# EAGLE design 5V Stepdown (EAGLE 9.6.2)

## Sheet 1 of 2: BOTTOM BOARD
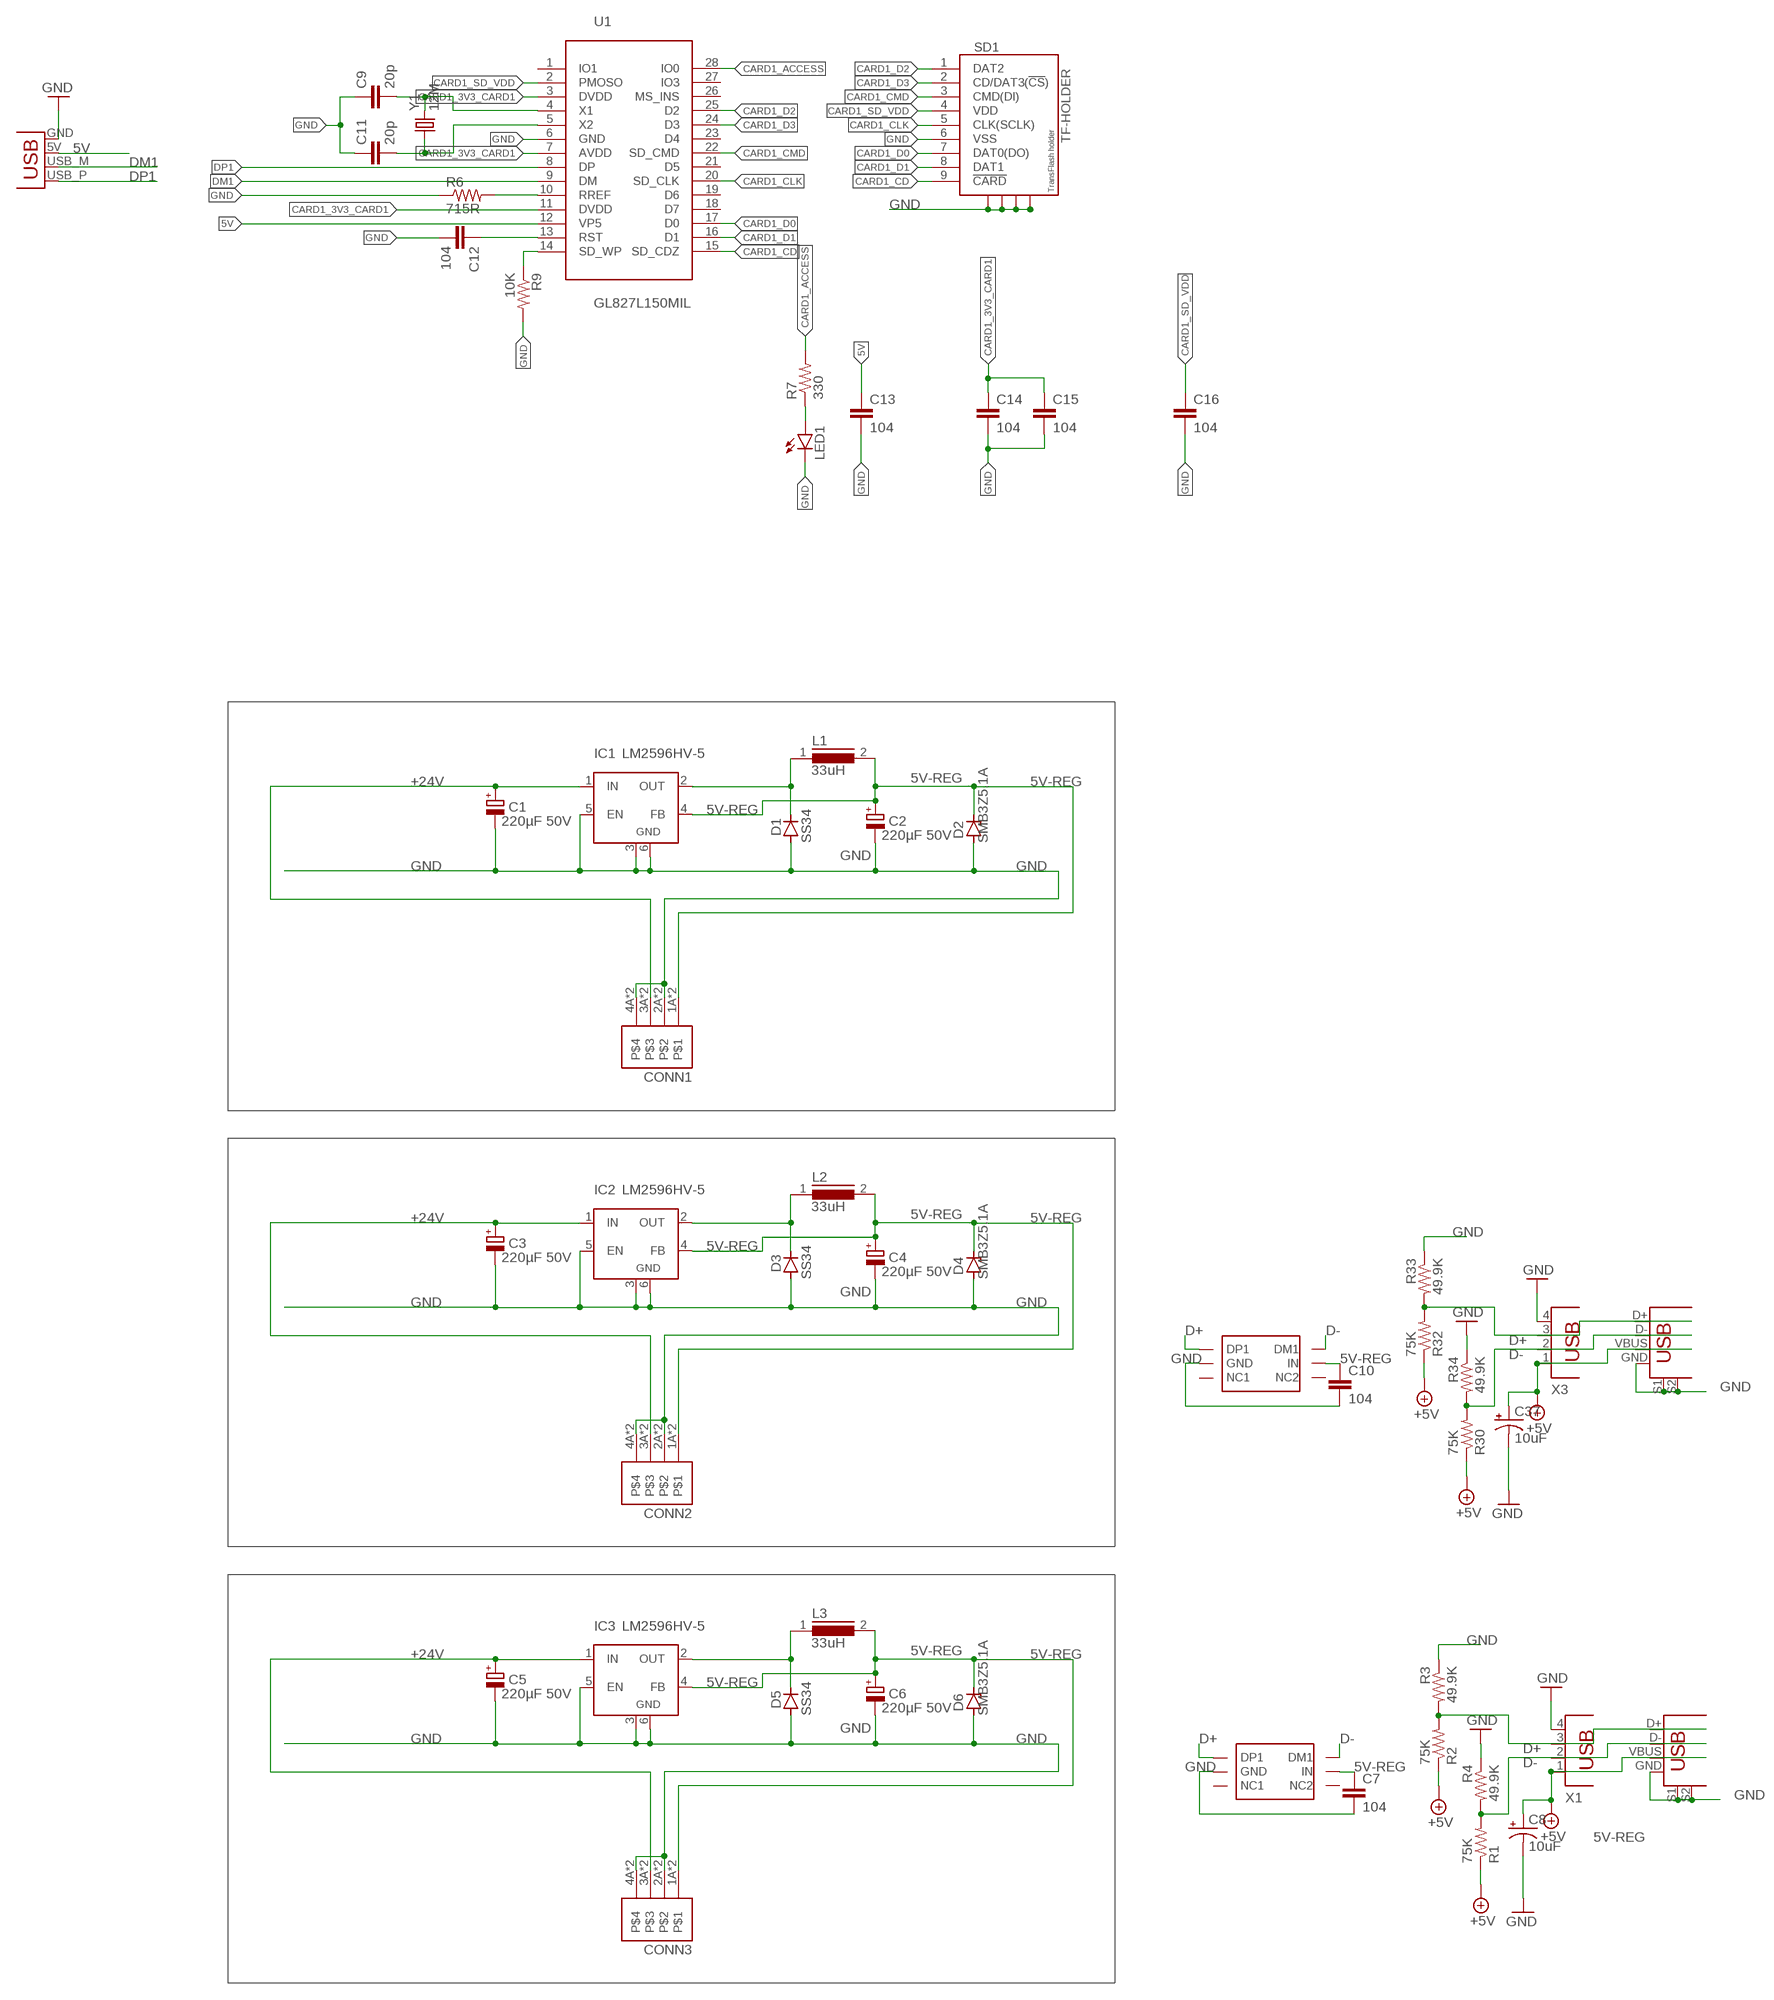
[diagram p0: schematic, sheet 1]

### Parts
C1  220µF 50V  CPOL-EUE  [PANASONIC_E]
C2  220µF 50V  CPOL-EUE  [PANASONIC_E]
C3  220µF 50V  CPOL-EUE  [PANASONIC_E]
C4  220µF 50V  CPOL-EUE  [PANASONIC_E]
C5  220µF 50V  CPOL-EUE  [PANASONIC_E]
C6  220µF 50V  CPOL-EUE  [PANASONIC_E]
C7  104  C-EUC1206  [C1206]
C8  10uF  CAP_POL1206  [EIA3216]
C9  20p  CAP1206  [1206]
C10  104  C-EUC1206  [C1206]
C11  20p  CAP1206  [1206]
C12  104  CAP1206  [1206]
C13  104  CAP1206  [1206]
C14  104  CAP1206  [1206]
C15  104  CAP1206  [1206]
C16  104  CAP1206  [1206]
C37  10uF  CAP_POL1206  [EIA3216]
CONN1  WJ212R-THR-3.5-4  [WJ212R-THR-3.5-4]
CONN2  WJ212R-THR-3.5-4  [WJ212R-THR-3.5-4]
CONN3  WJ212R-THR-3.5-4  [WJ212R-THR-3.5-4]
D1  SS34  D-SOD-87  [SOD87]
D2  SMB3Z5.1A  ZENER-DIODESMB  [SMB]
D3  SS34  D-SOD-87  [SOD87]
D4  SMB3Z5.1A  ZENER-DIODESMB  [SMB]
D5  SS34  D-SOD-87  [SOD87]
D6  SMB3Z5.1A  ZENER-DIODESMB  [SMB]
IC1  LM2596HV-5  LM2596S  [TO263-5]
IC2  LM2596HV-5  LM2596S  [TO263-5]
IC3  LM2596HV-5  LM2596S  [TO263-5]
L1  33uH  DR127  [DR127]
L2  33uH  DR127  [DR127]
L3  33uH  DR127  [DR127]
LED1  LED3MM  [LED3MM]
R1  75K  R-US_M1206  [M1206]
R2  75K  R-US_M1206  [M1206]
R3  49.9K  R-US_M1206  [M1206]
R4  49.9K  R-US_M1206  [M1206]
R6  715R  RESISTOR1206  [1206]
R7  330  RESISTOR1206  [1206]
R9  10K  RESISTOR1206  [1206]
R30  75K  R-US_M1206  [M1206]
R32  75K  R-US_M1206  [M1206]
R33  49.9K  R-US_M1206  [M1206]
R34  49.9K  R-US_M1206  [M1206]
SD1  TF-HOLDER  [TF-PULL]
U1  GL827L150MIL  [SSOP28-39]
U$1  TPS2514  [TPS2514]
U$2  TPS2514  [TPS2514]
U$3  USB+SHIELDUSB-A-S-NOSILK-FEMALE  [USB-A-S-NOSILK-FEMALE]
U$4  USB+SHIELDUSB-A-S-NOSILK-FEMALE  [USB-A-S-NOSILK-FEMALE]
X1  PN87520  [PN87520]
X2  USBPCB  [USB-A-PCB]
X3  PN87520  [PN87520]
Y1  12M  CRYSTAL2HC49US  [HC49US]

### Nets
5V: C13.1 U1.12(VP5) X2.5V(VBUS)
5V-REG: C2.+ C4.+ C6.+ C7.1 C8.A(+) C10.1 C37.A(+) CONN1.1A CONN1.1B CONN2.1A CONN2.1B CONN3.1A CONN3.1B D2.C D4.C D6.C IC1.4(FB) IC2.4(FB) IC3.4(FB) L1.2 L2.2 L3.2 R1.1 R2.1 R30.1 R32.1 U$1.IN U$2.IN U$3.VBUS U$4.VBUS X1.1 X3.1 ; supply symbol labelled +5V
+24V: C1.+ C3.+ C5.+ CONN1.3A CONN1.3B CONN2.3A CONN2.3B CONN3.3A CONN3.3B IC1.1(IN) IC2.1(IN) IC3.1(IN)
CARD1_3V3_CARD1: C14.1 C15.1 U1.3(DVDD) U1.7(AVDD) U1.11(DVDD)
CARD1_ACCESS: R7.2 U1.28(IO0)
CARD1_CD: SD1.9(!CARD) U1.15(SD_CDZ)
CARD1_CLK: SD1.5(CLK(SCLK)) U1.20(SD_CLK)
CARD1_CMD: SD1.3(CMD(DI)) U1.22(SD_CMD)
CARD1_D0: SD1.7(DAT0(DO)) U1.17(D0)
CARD1_D1: SD1.8(DAT1) U1.16(D1)
CARD1_D2: SD1.1(DAT2) U1.25(D2)
CARD1_D3: SD1.2(CD/DAT3(!CS!)) U1.24(D3)
CARD1_SD_VDD: C16.1 SD1.4(VDD) U1.2(PMOSO)
D+: R2.2 R3.2 R32.2 R33.2 U$1.DP1 U$2.DP1 U$3.D+ U$4.D+ X1.3 X3.3
D-: R1.2 R4.2 R30.2 R34.2 U$1.DM1 U$2.DM1 U$3.D- U$4.D- X1.2 X3.2
DM1: U1.9(DM) X2.USB_M(D-)
DP1: U1.8(DP) X2.USB_P(D+)
GND: C1.- C2.- C3.- C4.- C5.- C6.- C7.2 C8.C(-) C9.1 C10.2 C11.1 C12.2 C13.2 C14.2 C15.2 C16.2 C37.C(-) CONN1.2A CONN1.2B CONN1.4A CONN1.4B CONN2.2A CONN2.2B CONN2.4A CONN2.4B CONN3.2A CONN3.2B CONN3.4A CONN3.4B D1.2(A) D2.A D3.2(A) D4.A D5.2(A) D6.A IC1.3(GND) IC1.5(EN) IC1.6(GND) IC2.3(GND) IC2.5(EN) IC2.6(GND) IC3.3(GND) IC3.5(EN) IC3.6(GND) LED1.K(C) R3.1 R4.1 R6.1 R9.2 R33.1 R34.1 SD1.6(VSS) SD1.S1 SD1.S2 SD1.S3 SD1.S4 U1.6(GND) U$1.GND U$2.GND U$3.GND U$3.S1 U$3.S2 U$4.GND U$4.S1 U$4.S2 X1.4 X2.GND X3.4
N$2: C9.2 U1.4(X1) Y1.2
N$5: C11.2 U1.5(X2) Y1.1
N$10: R6.2 U1.10(RREF)
N$21: C12.1 U1.13(RST)
N$26: LED1.A R7.1
N$28: R9.1 U1.14(SD_WP)
SW-L: D1.1(C) IC1.2(OUT) L1.1
SW-L1: D3.1(C) IC2.2(OUT) L2.1
SW-L2: D5.1(C) IC3.2(OUT) L3.1
Unconnected: U1.1(IO1) U1.18(D7) U1.19(D6) U1.21(D5) U1.23(D4) U1.26(MS_INS) U1.27(IO3) U$1.NC2 U$1.NC(NC1) U$2.NC2 U$2.NC(NC1)

## Sheet 2 of 2

## Library data of the parts
C1-C6 = resistor:CPOL-EU: POLARIZED CAPACITOR, European symbol
C7 C10 = rcl:C-EU: CAPACITOR, European symbol
C8 C37 = SparkFun:CAP_POL: Capacitor Polarized These are standard SMD and PTH capacitors. Normally 10uF, 47uF, and 100uF in electrolytic and tantalum varieties. Always verify the external diameter of the through hole cap, it varies with capacity, voltage, and manufacturer. The EIA devices should be standard.
C9 C11-C16 = z_jlc_smt:CAP: Capacitor Standard 0603 ceramic capacitor, and 0.1" leaded capacitor.
CONN1-CONN3 = WJ212R-THR-3.5-3.81:WJ212R-THR-3.5-4
D1 D3 D5 = semicon-smd-ipc:D-: DIODE unfilled
D2 D4 D6 = diode:ZENER-DIODE: Z-Diode
IC1-IC3 = linear:LM2596S: STEP-DOWN VOLTAGE REGULATOR
L1-L3 = inductors:DR127: High Power Density, High Efficiency, Shielded Inductors Source: coiltronics_dr_series.pdf; SPICEPREFIX: L
LED1 = led:LED: LED OSRAM: - CHIPLED LG R971, LG N971, LY N971, LG Q971, LY Q971, LO R971, LY R971 LH N974, LH R974 LS Q976, LO Q976, LY Q976 LO Q996 - Hyper CHIPLED LW Q18S LB Q993, LB Q99A, LB R99A - SideLED LS A670, LO A670, LY A670, LG A670, LP A670 LB A673, LV A673, LT A673, LW A673 LH A674 LY A675 LS A676, LA A676, LO A676, LY A676, LW A676 LS A679, LY A679, LG A679 - Hyper Micro SIDELED® LS Y876, LA Y876, LO Y876, LY Y876 LT Y87S - SmartLED LW L88C, LW L88S LB L89C, LB L89S, LG L890 LS L89K, LO L89K, LY L89K LS L896, LA L896, LO L896, LY L896 - TOPLED LS T670, LO T670, LY T670, LG T670, LP T670 LSG T670, LSP T670, LSY T670, LOP T670, LYG T670 LG T671, LOG T671, LSG T671 LB T673, LV T673, LT T673, LW T673 LH T674 LS T676, LA T676, LO T676, LY T676, LB T676, LH T676, LSB T676, LW T676 LB T67C, LV T67C, LT T67C, LS T67K, LO T67K, LY T67K, LW E67C LS E67B, LA E67B, LO E67B, LY E67B, LB E67C, LV E67C, LT E67C LW T67C LS T679, LY T679, LG T679 LS T770, LO T770, LY T770, LG T770, LP T770 LB T773, LV T773, LT T773, LW T773 LH T774 LS E675, LA E675, LY E675, LS T675 LS T776, LA T776, LO T776, LY T776, LB T776 LHGB T686 LT T68C, LB T68C - Hyper Mini TOPLED® LB M676 - Mini TOPLED Santana® LG M470 LS M47K, LO M47K, LY M47K Source: http://www.osram.convergy.de LUXEON: - LUMILED® LXK2-PW12-R00, LXK2-PW12-S00, LXK2-PW14-U00, LXK2-PW14-V00 LXK2-PM12-R00, LXK2-PM12-S00, LXK2-PM14-U00 LXK2-PE12-Q00, LXK2-PE12-R00, LXK2-PE12-S00, LXK2-PE14-T00, LXK2-PE14-U00 LXK2-PB12-K00, LXK2-PB12-L00, LXK2-PB12-M00, LXK2-PB14-N00, LXK2-PB14-P00, LXK2-PB14-Q00 LXK2-PR12-L00, LXK2-PR12-M00, LXK2-PR14-Q00, LXK2-PR14-R00 LXK2-PD12-Q00, LXK2-PD12-R00, LXK2-PD12-S00 LXK2-PH12-R00, LXK2-PH12-S00 LXK2-PL12-P00, LXK2-PL12-Q00, LXK2-PL12-R00 Source: www.luxeon.com KINGBRIGHT: KA-3528ASYC Source: www.kingbright.com
R1-R4 R30 R32-R34 = adafruit:R-US_: RESISTOR, American symbol
R6 R7 R9 = z_jlc_smt:RESISTOR: Resistor Basic schematic elements and footprints for 0603, 1206, and PTH resistors.
SD1 = sd-mmc:TF-HOLDER: TF / Micro SD socket is PUSH-PUSH type, the card can be pushed into and auto locked and pushed out by simply press the card. Surface Mounting type.
U1 = xmgu2008:GL827L
U$1 U$2 = TPS2514:TPS2514
U$3 U$4 = SparkFun-Connectors:USB+SHIELD: USB+Shield USB connector with shield pins connectable
X1 X3 = con-berg:PN87520: BERG USB connector; OC_FARNELL: unknown; OC_NEWARK: unknown
X2 = SparkFun:USB: USB Connectors USB-B-PTH is fully proven SKU : PRT-00139 USB-miniB is fully proven SKU : PRT-00587 USB-A-PCB is untested. USB-A-H is throughly reviewed, but untested. Spark Fun Electronics SKU : PRT-00437 USB-B-SMT is throughly reviewed, but untested. Needs silkscreen touching up. USB-A-S has not been used/tested USB-MB-H has not been used/tested
Y1 = xmgu2008:CRYSTAL2: Various standard crystals. Proven footprints.

## Board
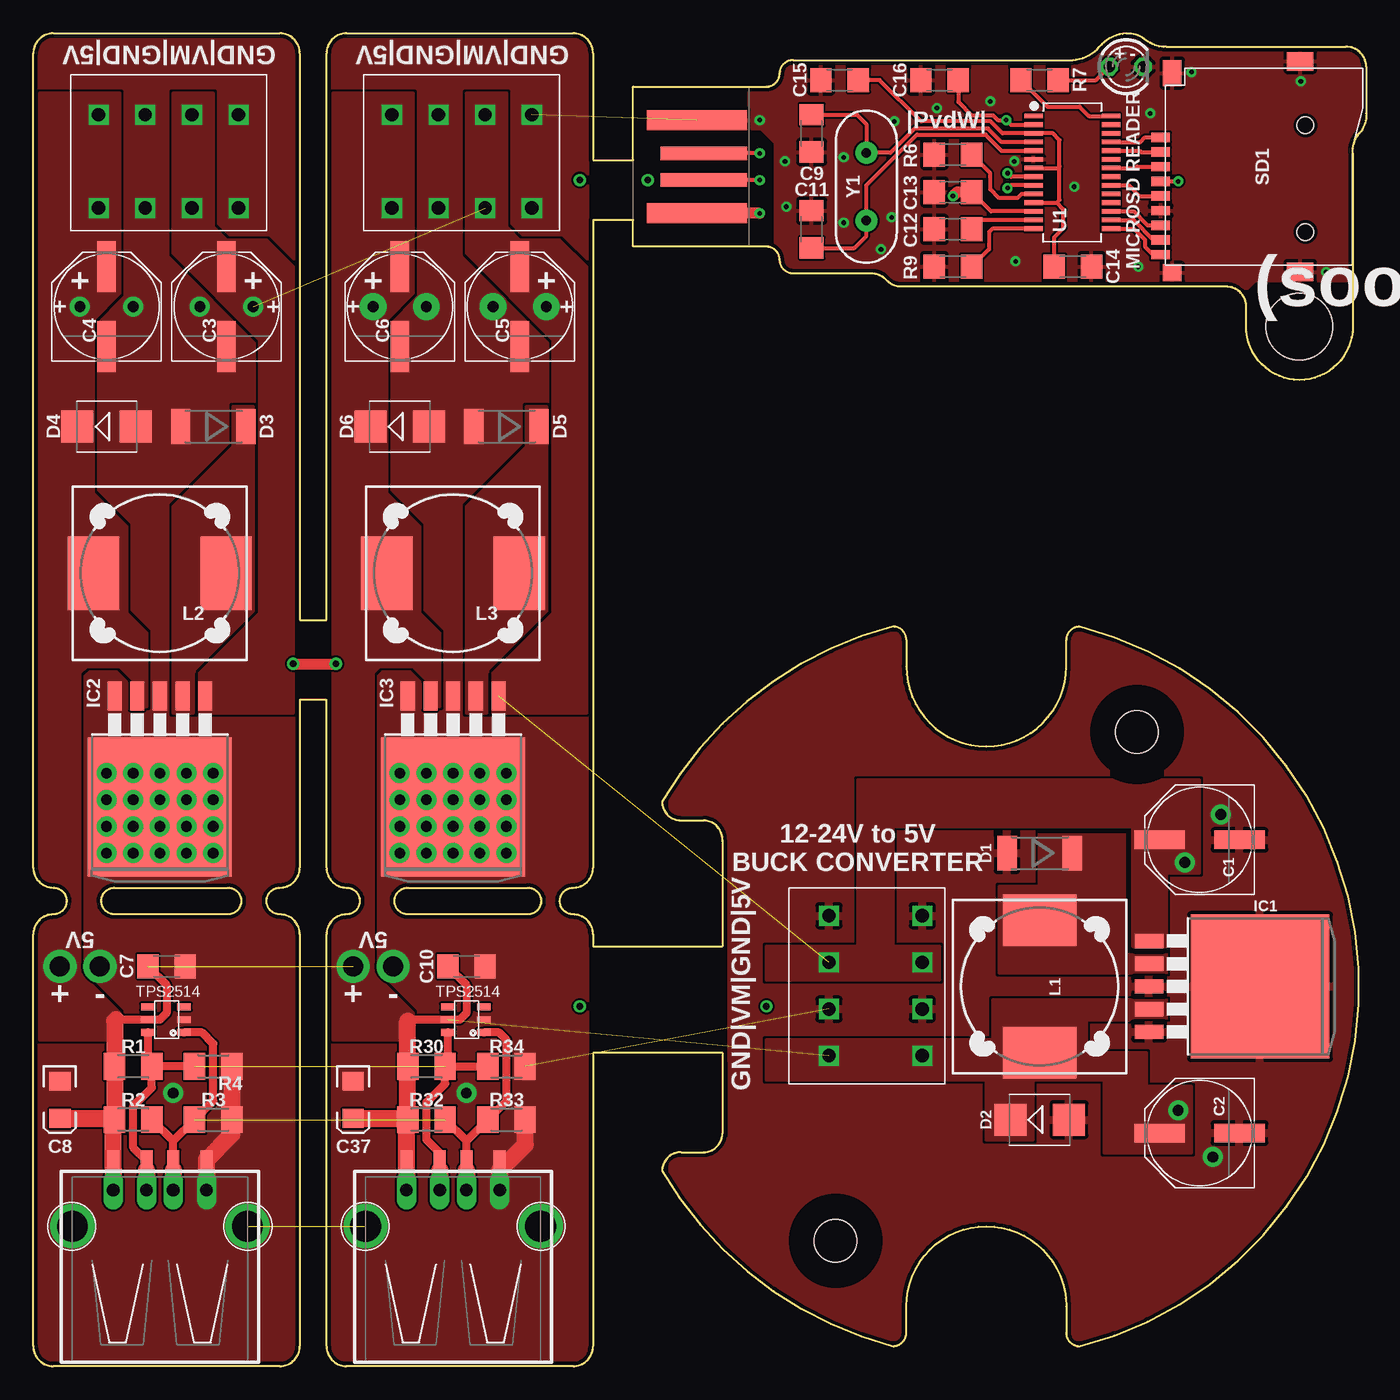
[diagram p1: board, top side]
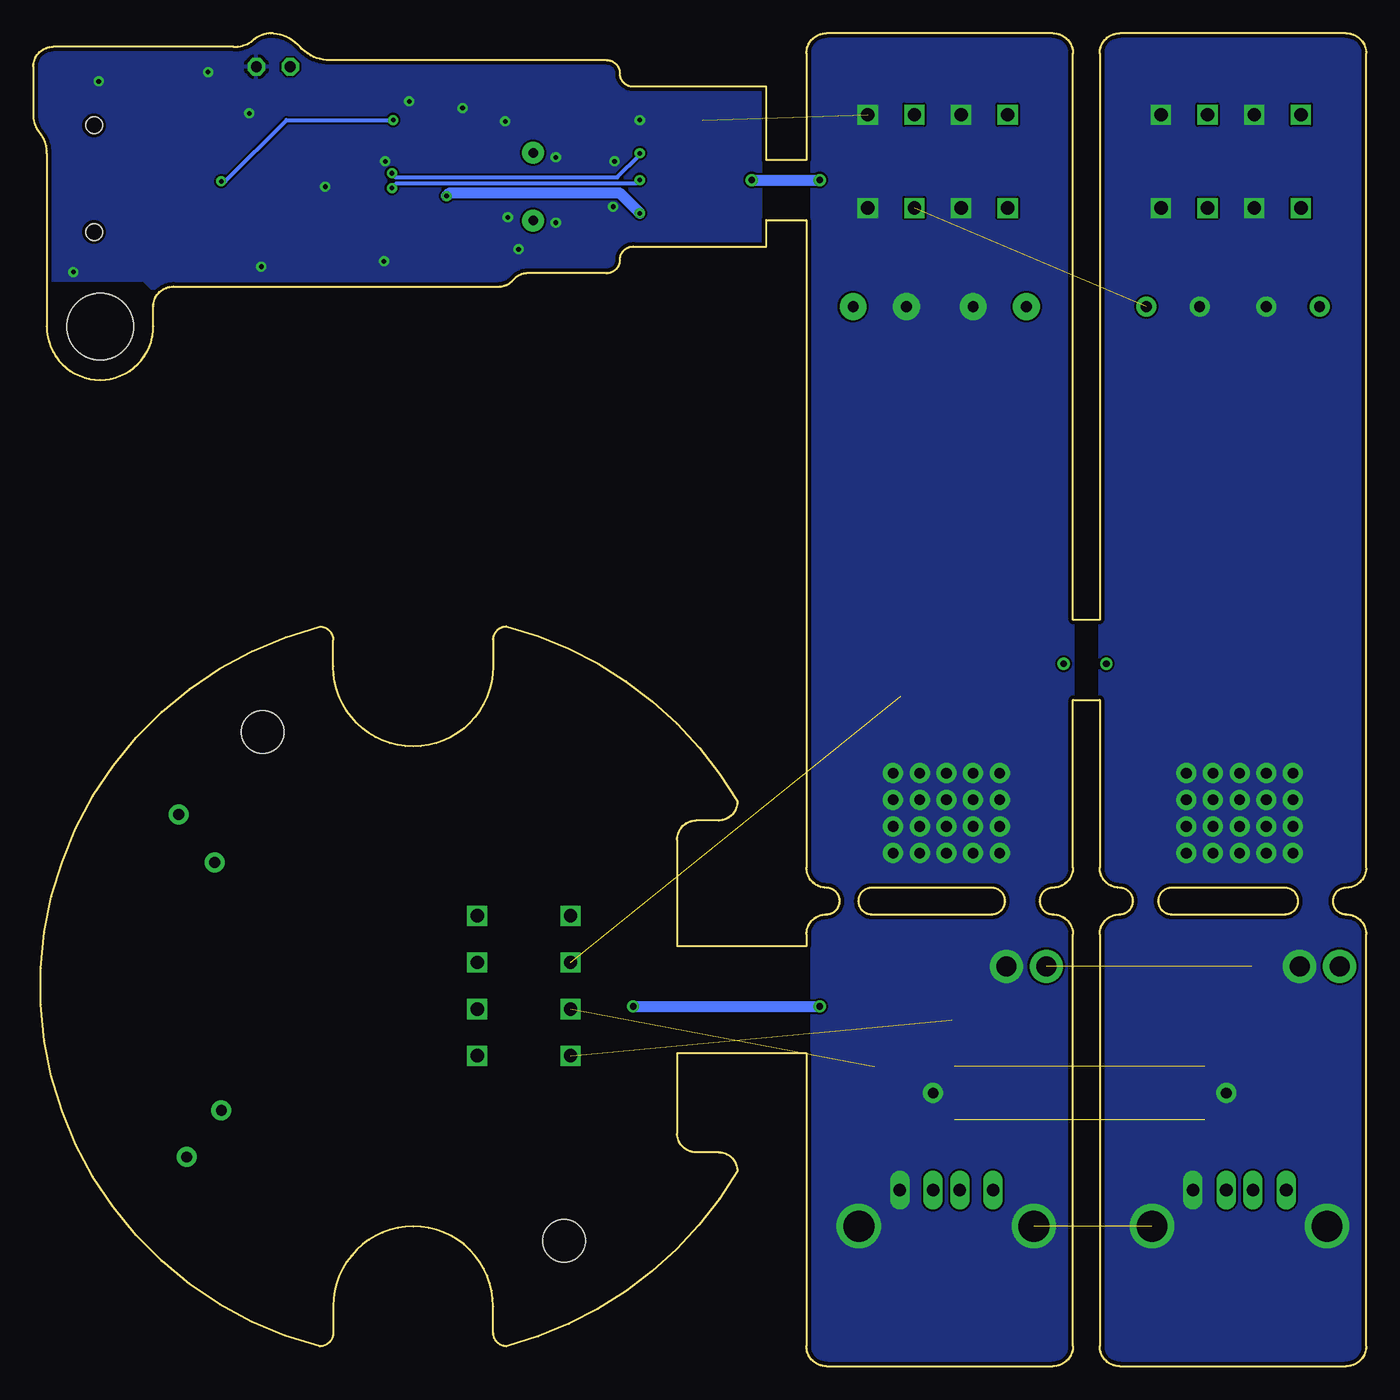
[diagram p2: board, bottom side, seen from below]

Size 100 x 100 mm. Coordinates in mm from the lower left corner, seen from the top.
Outline: 65.5,4.49 arc-180 77.5,4.49 77.5,2.49 arc89 78.5,1.49 arc151 78.5,55.49 arc87 77.5,54.5 77.5,52.5 arc-180 65.5,52.5 65.5,54.5 arc90 64.5,55.5 arc45 47.18,42.36 arc90 48.59,40.95 50.29,40.95 arc-90 51.7,39.5 arc4 51.7,39.4 51.7,31.5 42,31.5 42,32.4 arc90 40.5,33.9 arc-180 40.5,35.9 arc90 42,37.4 42,86 45,86 45,84 55,84 arc-90 56,83 arc90 57,82 63,82 arc-45 64,81.5 arc45 65,81 89.5,81 arc-90 91,79.5 91,78 arc180 99,78 99,91 arc-45 99.5,92.5 arc45 100,94 100,97.5 arc90 98.5,99 85,99 arc-45 83.5,99.5 arc45 82,100 arc45 80,99 arc-45 78,98 57,98 arc90 56,97 arc-90 55,96 45,96 45,90.5 42,90.5 42,98.5 arc90 40.5,100 23.5,100 arc90 22,98.5 22,56 20,56 20,98.5 arc90 18.5,100 1.5,100 arc90 0,98.5 0,37.4 arc90 1.5,35.9 arc-180 1.5,33.9 arc90 0,32.4 0,1.5 arc90 1.5,0 18.5,0 arc90 20,1.5 20,32.4 arc90 18.5,33.9 arc-180 18.5,35.9 arc90 20,37.4 20,50 22,50 22,37.4 arc90 23.5,35.9 arc-180 23.5,33.9 arc90 22,32.4 22,1.5 arc90 23.5,0 40.5,0 arc90 42,1.5 42,23.5 51.7,23.5 51.7,17.47 arc-90 50.29,16.05 48.59,16.05 arc90 47.18,14.64 arc45 64.5,1.49 arc87 65.5,2.49 65.5,4.49
Outline: 28.1,33.9 arc-180 28.1,35.9 37.1,35.9 arc-180 37.1,33.9 28.1,33.9
Outline: 6.1,33.9 arc-180 6.1,35.9 14.6,35.9 arc-180 14.6,33.9 6.1,33.9
Copper layers (1*16): Top 0.035mm / dielectric 1.5mm / Bottom 0.035mm
Design rules "default *": minimum track width 6mil, minimum drill 0.35mm, track to track 6mil, track to pad 6mil, pad to pad 6mil, via to via 6mil, smd to smd 6mil, copper to edge 10mil, drill to drill 6mil, minimum pad ring 10mil, minimum via ring 8mil, stop-mask expansion 4mil, vias tented up to drill 20mil, thermal gap 10mil
Holes 3.2 mm at 60.19,9.41 82.81,47.59
Holes 5 mm at 95,78
tRestrict: area 57.7,6.9 to 62.7,11.9; area 80.3,45.1 to 85.3,50.1
bRestrict: area 57.7,6.9 to 62.7,11.9; area 80.3,45.1 to 85.3,50.1

### Footprints (pad centres in the part's own frame; a part is rotated, then mirrored left to right if it is on the bottom)
PANASONIC_E = smd 3.8 x 1.4: + 3,0; - -3,0
C1206 = smd 1.6 x 1.8: 1 -1.4,0; 2 1.4,0
EIA3216 = smd 1.4 x 1.6: A 1.4,0; C -1.4,0
1206 = smd 1.6 x 1.8: 1 -1.4,0; 2 1.4,0
WJ212R-THR-3.5-4 = drill 1 square: 1A 12.6,10.6; 1B 12.6,3.6; 2A 9.1,10.6; 2B 9.1,3.6; 3A 5.6,10.6; 3B 5.6,3.6; 4A 2.1,10.6; 4B 2.1,3.6
SOD87 = smd 1.45 x 2.6: 1 -2.445,0; 2 2.445,0
SMB = smd 2.4 x 2.4: A 2.2,0; C -2.2,0
TO263-5 = smd 1.067 x 2.159: 1 -3.404,-5.791; 2 -1.702,-5.791; 3 0,-5.791; 4 1.702,-5.791; 5 3.404,-5.791 | smd 10.8 x 10.41: 6 0,2.54
DR127 = smd 3.85 x 5.5: 1 -4.975,0; 2 4.975,0
LED3MM = drill 0.813 octagon: A -1.27,0; K 1.27,0
M1206 = smd 1.6 x 2: 1 -1.4,0; 2 1.4,0
TF-PULL = smd 0.7 x 1.4: 1 -2.2,-7.62; 2 -1.1,-7.62; 3 0,-7.62; 4 1.1,-7.62; 5 2.2,-7.62; 6 3.3,-7.62; 7 4.4,-7.62; 8 5.5,-7.62; 9 6.6,-7.62 | smd 1.4 x 2: S1 -7.9,2.85; S2 7.9,2.85 | smd 1.28 x 1.4: S3 7.96,-6.75 | smd 1.95 x 1.4: S4 -7.025,-6.75 | hole 1.25: -3.1,3.25; 4.9,3.25
SSOP28-39 = smd 0.348 x 1.397: 1 -4.225,-3.656; 2 -3.575,-3.656; 3 -2.925,-3.656; 4 -2.275,-3.656; 5 -1.625,-3.656; 6 -0.975,-3.656; 7 -0.325,-3.656; 8 0.325,-3.656; 9 0.975,-3.656; 10 1.625,-3.656; 11 2.275,-3.656; 12 2.925,-3.656; 13 3.575,-3.656; 14 4.225,-3.656; 15 4.225,2.156; 16 3.575,2.156; 17 2.925,2.156; 18 2.275,2.156; 19 1.625,2.156; 20 0.975,2.156; 21 0.325,2.156; 22 -0.325,2.156; 23 -0.975,2.156; 24 -1.625,2.156; 25 -2.275,2.156; 26 -2.925,2.156; 27 -3.575,2.156; 28 -4.225,2.156
TPS2514 = smd 1.016 x 0.508: DM1 1.4,0.95; DP1 -1.3,0.955; GND -1.3,0; IN 1.4,0; NC -1.3,-0.95; NC2 1.4,-0.95
USB-A-S-NOSILK-FEMALE = smd 3 x 0.9: D+ 4.212,-1; D- 4.212,1; GND 4.212,-3.5; VBUS 4.212,3.5 | drill 2.311: S1 0,-6.566; S2 0,6.566
PN87520 = drill 0.95 long: 1 -3.5,2.71; 2 -1,2.71; 3 1,2.71; 4 3.5,2.71
USB-A-PCB = smd 7.5 x 1.5: 5V -0.2,-3.5; GND -0.2,3.5 | smd 6.5 x 1: USB_M 0.3,-1; USB_P 0.3,1
HC49US = drill 0.7 pad 1.651: 1 -2.54,0; 2 2.54,0

### Placement (x,y rotation side)
C1  87.5,39.49 180 top
C2  87.5,17.49 180 top
C3  14.5,79.5 90 top
C4  5.5,79.5 90 top
C5  36.5,79.5 90 top
C6  27.5,79.5 90 top
C7  10,30 0 top
C8  2,20 270 top
C9  58.4,92.5 90 top
C10  32.5,30 0 top
C11  58.4,85.3 270 top
C12  69,85.3 180 top
C13  69,88.1 180 top
C14  78,82.5 0 top
C15  60.5,96.5 180 top
C16  68,96.5 180 top
C37  24,20 270 top
CONN1  56.1,35.89 270 top
CONN2  17.5,97.5 180 top
CONN3  39.5,97.5 180 top
D1  75.5,38.49 180 top
D2  75.5,18.49 0 top
D3  13.5,70.5 180 top
D4  5.5,70.5 0 top
D5  35.5,70.5 180 top
D6  27.5,70.5 0 top
IC1  89.5,28.49 270 top
IC2  9.5,44.5 180 top
IC3  31.5,44.5 180 top
L1  75.5,28.49 270 top
L2  9.5,59.5 180 top
L3  31.5,59.5 180 top
LED1  82,97.5 0 top
R1  7.5,22.5 0 top
R2  7.5,18.5 0 top
R3  13.5,18.5 180 top
R4  13.5,22.5 180 top
R6  69,90.9 0 top
R7  75.5,96.5 180 top
R9  69,82.5 180 top
R30  29.5,22.5 0 top
R32  29.5,18.5 0 top
R33  35.5,18.5 180 top
R34  35.5,22.5 180 top
SD1  92.2,90 270 top
U1  78.7,89.57 270 top
U$1  32.5,26 180 top
U$2  10,26 180 top
U$3  31.5,10.5 90 top
U$4  9.5,10.5 90 top
X1  9.5,10.5 0 top
X2  50,90 0 top
X3  31.5,10.5 0 top
Y1  62.5,88.5 90 top

### Tracks (layer width: path | path; a pad name or v marks a point on that pad's centre or on a via)
5V  (via drill 0.35)
  Top 0.305: U1.12 71.86,86.64 C13.1
  Top 0.813: C13.1 69.3,88.1 v69,87.8 | v54.5,86.5 X2.5V
  Bottom 0.813: v69,87.8 68.77,88.03 56.03,88.03 v54.5,86.5
5V-REG  (via drill 0.8 pad 1.5, 0.8 pad 2, 1.5 pad 2.5)  (2 unrouted)
  Top 0.61: 6.2,26 U$2.IN 9.5,26 10,26.5 10,28.6 C7.1 | 28.1,25.9 28.2,26 U$1.IN 32,26 32.5,26.5 32.5,28.6 C10.1
  Top 1.27: R2.1 R1.1 6.1,25.9 6.2,26 | X1.1 U$4.VBUS 6,18.4 R2.1 | X3.1 U$3.VBUS 28,18.4 | 28,18.4 R32.1 R30.1 28.1,25.9 | C37.A 27.8,18.6 28,18.4 | C8.A 6,18.6 R2.1
  other vias: 3.5,79.5 25.5,79.5 2,30 24,30 85.9,19.2
  pour Top (isolate 0.406, rank 3, no thermals): 55,24.49 72,24.49 72,27.49 85,27.49 85,25.99 79,25.99 79,23.49 83.5,23.49 83.5,20.99 86.9,20.99 86.9,15.99 80.35,15.99 80.35,21.49 75,21.49 75,16.99 71.5,16.99 71.5,21.49 55,21.49
  pour Top (no thermals): 6.5,95.5 6.5,80.5 4.5,78.5 4.5,65.5 7,63 7,56.5 8.5,55 8.5,49.5 7.5,49.5 7.5,51.5 6.5,52.5 4,52.5 3.5,52 3.5,29.5 6.5,26.5 6.5,24.5 0.5,24.5 0.5,95.5
  pour Top (no thermals): 28.5,95.5 28.5,80.5 26.5,78.5 26.5,65.5 29,63 29,56.5 30.5,55 30.5,49.5 29.5,49.5 29.5,51.5 28.5,52.5 26,52.5 25.5,52 25.5,29.5 28.5,26.5 28.5,24.5 22.5,24.5 22.5,95.5
+24V  (via drill 0.8 pad 1.5, 0.8 pad 2)  (2 unrouted)
  other vias: 38.5,79.5 16.5,79.5 86.4,37.8
  pour Top (isolate 0.406, no thermals): 85,31.49 82.5,31.49 82.5,40.49 64.51,40.49 64.51,31.49 68,31.49 68,28.99 55,28.99 55,31.49 61.85,31.49 61.85,43.99 87.5,43.99 87.5,36.99 85,36.99
  pour Top (no thermals): 10.5,95.5 10.5,83.5 17,77 17,56.5 12.5,52 12.5,49 19.5,49 19.5,82.5 17.5,84.5 14.5,84.5 13.5,85.5 13.5,95.5
  pour Top (no thermals): 32.5,95.5 32.5,83.5 39,77 39,56.5 34.5,52 34.5,49 41.5,49 41.5,82.5 39.5,84.5 36.5,84.5 35.5,85.5 35.5,95.5
CARD1_3V3_CARD1
  Top 0.305: C15.1 63.5,96.5 66.6,93.4 71.82,93.4 72.72,92.5 U1.3 76.5,92.5 77,92 77,90 | U1.11 76.8,87.3 | 76.8,87.3 77,87.5 77,90 | U1.7 76.89,89.89 77,90 | C14.1 76.6,84.7 77.3,85.4 77.3,86.79 76.8,87.3
CARD1_ACCESS
  Top 0.305: R7.2 76.1,94.5 78.5,94.5 79.2,93.8 U1.28
CARD1_CD
  Top 0.305: U1.15 82.56,85.34 83.4,84.51 83.4,84 84,83.4 SD1.9
CARD1_CLK
  Top 0.305: U1.20 82.2,88.59 83,87.8 SD1.5
CARD1_CMD
  Top 0.305: U1.22 82.69,89.89 82.8,90 SD1.3
CARD1_D0
  Top 0.305: U1.17 82.56,86.64 83.6,85.6 SD1.7
CARD1_D1
  Top 0.305: U1.16 82.56,86 84.05,84.5 SD1.8
CARD1_D2
  Top 0.305: U1.25 83.05,91.84 83.4,92.2 SD1.1
CARD1_D3
  Top 0.305: U1.24 83,91.19 83.1,91.1 SD1.2
CARD1_SD_VDD  (via drill 0.35)
  Top 0.305: SD1.4 v85.9,88.9 | U1.2 73.36,93.14 v73,93.5 72.36,93.5 72.01,93.86 70.4,93.86 69.4,94.86 C16.1
  Bottom 0.305: v85.9,88.9 85.6,88.9 81,93.5 v73,93.5
D+  (1 unrouted)
  Top 0.61: U$3.D+ 32.5,16.9 | 32.5,16.9 R32.2 | 32.5,16.9 R33.2 35.5,19.9 35.5,24.5 34.95,25.05 U$1.DP1 | U$4.D+ 10.5,16.9 | 10.5,16.9 R2.2 | 10.5,16.9 R3.2 13.5,19.9 13.5,24.2 12.65,25.05 U$2.DP1
  Top 1.27: U$4.D+ X1.3 | U$3.D+ X3.3
D-  (1 unrouted)
  Top 0.61: U$4.D- 8.5,15.4 7.5,16.4 7.5,19.55 7.91,19.96 7.96,19.96 8.9,20.9 R1.2 | R4.2 R1.2 | U$3.D- 30.5,16 29.5,17 29.5,19.8 30.9,21.2 R30.2 | R30.2 R34.2 | U$2.DM1 8.6,22.8 R1.2 | U$1.DM1 31.1,22.7 R30.2
  Top 1.27: U$4.D- X1.2 | U$3.D- X3.2
DM1  (via drill 0.35)
  Top 0.305: U1.9 73.3,88.59 v73.1,88.4 | v54.5,89 X2.USB_M
  Bottom 0.305: v73.1,88.4 72.76,88.74 54.76,88.74 v54.5,89
DP1  (via drill 0.35)
  Top 0.305: U1.8 73.36,89.25 v73.1,89.51 | v54.5,91 X2.USB_P
  Bottom 0.305: v73.1,89.51 72.79,89.2 56.2,89.2 54.5,90.9 v54.5,91
GND  (via drill 0.35, 0.8 pad 1.5, 0.8 pad 2, 1.5 pad 2.5)  (3 unrouted)
  Top 1.27: R4.1 R3.1 14.9,17.4 13,15.5 U$4.GND X1.4 | X3.4 U$3.GND 36.9,16.61 R33.1
  other vias: 71.8,94.9 67.8,94.4 64.6,93.4 64.4,86.2 78.1,88.5 82.9,82.5 83.8,94 95.1,96.4 86.9,97.1 97,82.1 73.7,82.9 63.6,83.8 56.4,90.4 60.8,90.7 60.8,85.8 56.5,87 54.5,93.5 73.6,90.4 12.5,79.5 7.5,79.5 29.5,79.5 34.5,79.5 5,30 27,30 89.1,41.4 88.5,15.7 9.5,44.5 7.5,44.5 5.5,44.5 11.5,44.5 13.5,44.5 13.5,42.5 11.5,42.5 9.5,42.5 7.5,42.5 5.5,42.5 5.5,40.5 7.5,40.5 9.5,40.5 11.5,40.5 13.5,40.5 13.5,38.5 11.5,38.5 9.5,38.5 7.5,38.5 5.5,38.5 31.5,44.5 29.5,44.5 27.5,44.5 27.5,42.5 29.5,42.5 31.5,42.5 33.5,42.5 35.5,42.5 35.5,44.5 33.5,44.5 35.5,40.5 35.5,38.5 33.5,40.5 33.5,38.5 31.5,40.5 31.5,38.5 29.5,40.5 29.5,38.5 27.5,40.5 27.5,38.5 32.5,20.5 10.5,20.5
  pour Top (rank 6): 53.7,95.9 53.7,94.1 46.2,94.1 46.2,92.9 54.6,92.9 55.5,92 55.7,91.8 55.7,86.6 55.7,83.4 57.1,82 63.5,82 64.6,80.9 91.1,80.9 91.7,81.5 98.8,81.5 98.9,81.6 98.9,91.5 99.7,92.3 100.1,92.7 100.1,97.9 98.8,99.2 86.9,99.2 84.3,99.2 83.4,100.1 80.5,100.1 78.5,98.1 56.8,98.1 55.6,96.9 54.7,96.9
  pour Bottom (rank 6): 53.8,96 45.5,96 45.5,84 55.7,84 55.7,83.4 57.1,82 63.5,82 64.6,80.9 91.1,80.9 91.7,81.5 98.8,81.5 98.9,81.6 98.9,91.5 100.1,92.7 100.1,97.9 98.8,99.2 84.3,99.2 83.4,100.1 80.5,100.1 78.5,98.1 56.8,98.1 55.6,96.9 54.7,96.9
  pour Top (rank 6): 77.5,54.49 77.5,52.49 arc-180 65.5,52.49 65.5,54.49 64.5,55.49 arc45 47.3,42.39 47.9,41 51.1,40.99 52.3,39.98 52.4,17.1 51.8,16.5 51.3,15.9 50.2,15.7 47.7,15.7 47.3,15.3 47.3,14.5 arc44 64.5,1.49 65.5,2.49 65.5,4.99 arc-170 77.5,4.99 77.5,2.49 78.5,1.49 arc152 78.5,55.49
  pour Top (rank 6, no thermals): 0,100 20,100 20,0 0,0
  pour Top (rank 6, no thermals): 22,100 41.6,100 41.6,0 22,0
  pour Bottom (rank 6, no thermals): 0,100 20,100 20,0 0,0
  pour Bottom (rank 6, no thermals): 22,100 41.6,100 41.6,0 22,0
LINK1  (via drill 0.5)
  Bottom 0.813: v46.1,89 v41,89
LINK2  (via drill 0.5)
  Top 0.813: v19.5,52.7 v22.7,52.7
LINK3  (via drill 0.5)
  Bottom 0.813: v55,27 v41,27
N$2
  Top 0.305: U1.4 72.64,91.84 71.63,92.86 66.11,92.86 64.29,91.04 Y1.2 62.5,93.2 61.8,93.9 C9.2
N$5
  Top 0.305: U1.5 72.65,91.19 71.44,92.4 66.3,92.4 62.5,88.6 Y1.1 62.5,84.8 61.6,83.9 C11.2
N$10
  Top 0.305: U1.10 74.14,87.94 73.84,87.64 72.45,87.64 71.8,88.3 71.8,89.5 R6.2
N$21
  Top 0.305: U1.13 71.09,86 C12.1
N$26
  Top 0.305: R7.1 79.73,96.5 LED1.A
N$28
  Top 0.305: U1.14 71.94,85.34 71.7,85.1 71.7,83.8 R9.1
SW-L
  pour Top (isolate 0.406, rank 2, no thermals): 75.5,39.99 75.5,35.99 72.5,35.99 72.5,29.49 85,29.49 85,30.99 82,30.99 82,39.99
SW-L1
  pour Top (rank 2, no thermals): 12,49 12,52 16.5,56.5 16.5,72 15,72 15,69 10.5,64.5 10.5,49
SW-L2
  pour Top (rank 2, no thermals): 34,49 34,52 38.5,56.5 38.5,72 37,72 37,69 32.5,64.5 32.5,49

### Text on the board
tPlace: GND|VM|GND|5V | GND|VM|GND|5V | + | - | |PvdW| | MICROSD READER | + | + | + | + | + | + | + | + | todo max2323 / todo karkas throttle / (soos multimeter selector pcb met spoed) / / Drill Batt Solar Charger / / Multi relay mains / / RJ45 WS2812s | 12-24V to 5V / BUCK CONVERTER | 5V | 5V | GND|VM|GND|5V | + | - | + | -